# EasyEDA Pro project DRV8262_breakout_2024-04-23.epro

# Schematic DRV8262_breakout
Create Date: 2024-03-21; Page Name: P1; Project Name: DRV8262_breakout; Schematic Name: DRV8262_breakout_5; Update Date: 2024-04-23; Company: Tux-Robotik; Drawn: Louis Bertelsmann; Page Size: A5; Part Number: DRV8262; Reviewed: Louis Bertelsmann; Version: V1.0
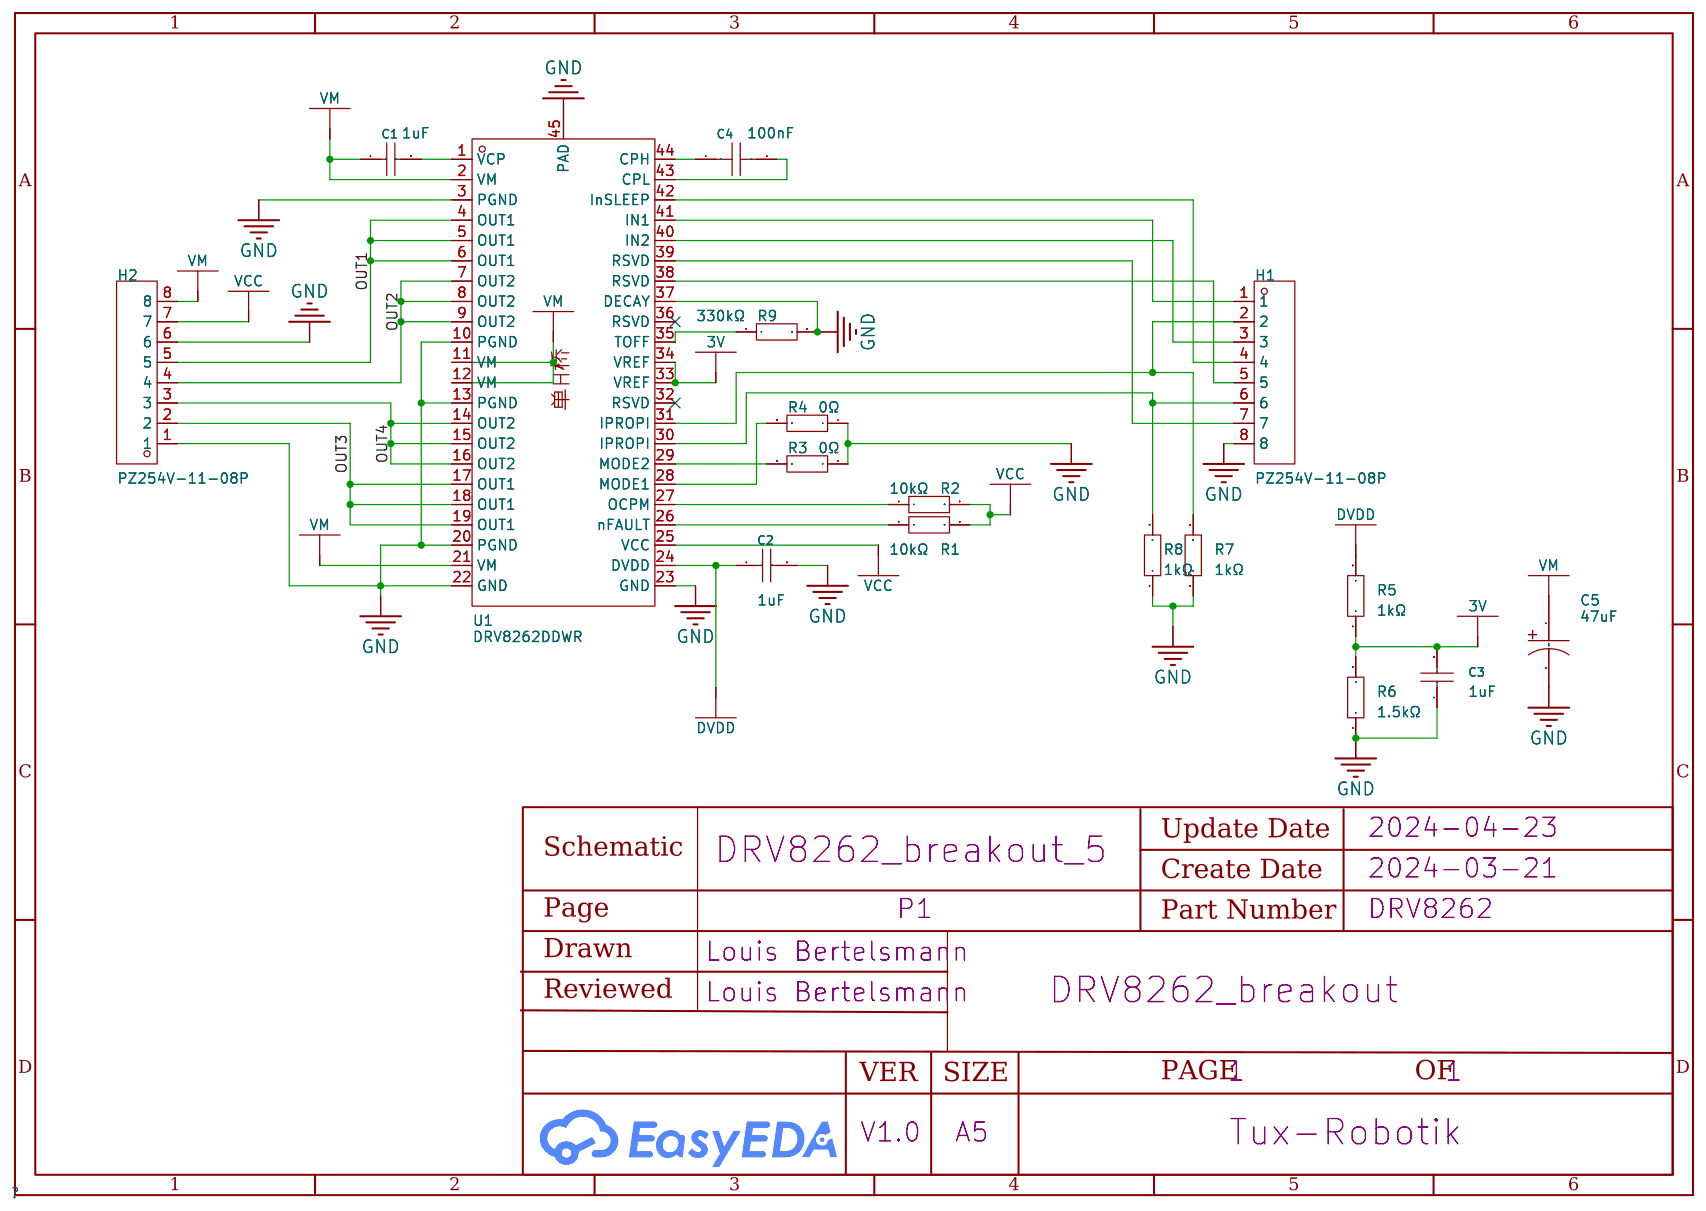
[diagram p0: schematic sheet]

## Parts
C1  1uF  [C0603]
C2  1uF  [C0603]
C3  1uF  [C0603]
C4  100nF  [C0603]
C5  47uF  [CAP-SMD_BD6.3-L6.6-W6.6-LS7.2-FD]
H1  PZ254V-11-08P  [HDR-TH_8P-P2.54-V-M]
H2  PZ254V-11-08P  [HDR-TH_8P-P2.54-V-M]
R1  10kΩ  [R0603]
R2  10kΩ  [R0603]
R3  0Ω  [R0603]
R4  0Ω  [R0603]
R5  1kΩ  [R0603]
R6  1.5kΩ  [R0603]
R7  1kΩ  [R0603]
R8  1kΩ  [R0603]
R9  330kΩ  [R0603]
U1  DRV8262DDWR  [HTSSOP-44_L14.0-W6.1-P0.64-LS8.1-BL-EP-2]

## Library data of the parts
C1-C3 = CL10A105KB8NNNC: Capacitance: Tolerance:±10% Tolerance:±10% Voltage Rated: Temperature Coefficient:; LCSC Part Name: 1uF ±10% 50V; Supplier Part: C15849; Manufacturer: SAMSUNG(三星); Supplier Footprint: 0603; JLCPCB Part Class: Basic Part; Datasheet: https://atta.szlcsc.com/upload/public/pdf/source/20160218/1457707763339.pdf; Supplier: LCSC; Tolerance: ±10%
C4 = CL10B104KC8NNNC: Capacitance: Tolerance:±10% Tolerance:±10% Voltage Rated: Temperature Coefficient:; LCSC Part Name: 100nF ±10% 100V; Supplier Part: C15725; Manufacturer: SAMSUNG(三星); Supplier Footprint: 0603; JLCPCB Part Class: Extended Part; Datasheet: https://atta.szlcsc.com/upload/public/pdf/source/20160218/1457707763339.pdf; Supplier: LCSC; Tolerance: ±10%
C5 = MVK25V47M6.3*5 6.3TP: Capacitance: Tolerance:±20% Tolerance:±20% Rated Voltage: Ripple Current:- Equivalent Series Resistance(ESR):- φD: L: Lifetime @ Temp:1000hrs@105℃ Operating Temperature:-40℃~+105℃ Operating Temperature:-40℃~+105℃; LCSC Part Name: 47uF ±20% 25V; Supplier Part: C346941; Manufacturer: SAMYOUNG(韩国三莹); Supplier Footprint: SMD,D6.3xL5mm; JLCPCB Part Class: Extended Part; Datasheet: https://atta.szlcsc.com/upload/public/pdf/source/20181213/C346985_7C716E870CB004139321FDD94F15CCBE.pdf; Supplier: LCSC; Tolerance: ±20%; Lifetime @ Temp: 1000hrs@105℃; Operating Temperature: -40℃~+105℃
H1 H2 = PZ254V-11-08P: Pin Structure:1x8P Pitch:2.54mm Row Spacing:- Circluar Pins/Square Pins:Square Pins Mounting Type:Straight Number of Rows:Plugin Number of Pins:8P Current Rating (Max):- Voltage Rating (Max):- Length of Mating Pin:6mm Insulation Height:2.5mm Length of End; LCSC Part Name: 间距:2.54mm 1x8P 直插 方针; Supplier Part: C492407; Manufacturer: XFCN(兴飞); Supplier Footprint: 插件,P=2.54mm; JLCPCB Part Class: Extended Part; Datasheet: https://atta.szlcsc.com/upload/public/pdf/source/20200309/C492407_83A6FB26A2233368EDB9516968EC6149.pdf; Supplier: LCSC; Pin Structure: 1x8P; Pitch: 2.54mm; Circluar Pins/Square Pins: Square Pins; Mounting Type: Straight; Number of Rows: Plugin; Number of Pins: 8P; Length of Mating Pin: 6mm; Insulation Height: 2.5mm; Length of End Connection Pin: 3mm; Operating Temperature Range: -40℃~+105℃; Color: Black
R1 R2 = AC0603FR-0710KL: Type:Thick Film Resistors Resistance: Tolerance:±1% Tolerance:±1% Power(Watts): Overload Voltage (Max): Temperature Coefficient:±100ppm/℃ Temperature Coefficient:±100ppm/℃ Operating Temperature Range:-55℃~+155℃ Operating Temperature Range:-55℃~+155℃; LCSC Part Name: 厚膜电阻 10kΩ ±1% 100mW; Supplier Part: C116677; Manufacturer: YAGEO(国巨); Supplier Footprint: 0603; JLCPCB Part Class: Extended Part; Datasheet: https://atta.szlcsc.com/upload/public/pdf/source/20180927/C229861_4ABDC471507C1ED6AFB4BA66AFC8620A.pdf; Supplier: LCSC; Type: Thick Film Resistors; Tolerance: ±1%; Temperature Coefficient: ±100ppm/℃; Operating Temperature Range: -55℃~+155℃
R3 R4 = RC0603JR-070RL: Type:Thick Film Resistors Resistance: Tolerance:±5% Tolerance:±5% Power(Watts): Overload Voltage (Max): Operating Temperature Range:-55℃~+155℃ Operating Temperature Range:-55℃~+155℃; LCSC Part Name: 厚膜电阻 0Ω ±5% 100mW; Supplier Part: C95177; Manufacturer: YAGEO(国巨); Supplier Footprint: 0603; JLCPCB Part Class: Extended Part; Datasheet: https://atta.szlcsc.com/upload/public/pdf/source/20170818/C126805_1503051298841895366.pdf; Supplier: LCSC; Type: Thick Film Resistors; Tolerance: ±5%; Operating Temperature Range: -55℃~+155℃
R5 R7 R8 = RC0603FR-071KL: Type:Thick Film Resistors Resistance: Tolerance:±1% Tolerance:±1% Power(Watts): Overload Voltage (Max): Temperature Coefficient:±100ppm/℃ Temperature Coefficient:±100ppm/℃ Operating Temperature Range:-55℃~+155℃ Operating Temperature Range:-55℃~+155℃; LCSC Part Name: 厚膜电阻 1kΩ ±1% 100mW; Supplier Part: C22548; Manufacturer: YAGEO(国巨); Supplier Footprint: 0603; JLCPCB Part Class: Extended Part; Datasheet: https://atta.szlcsc.com/upload/public/pdf/source/20180316/70C0E2BDAE7FCC62C531A5A58D202EE1.pdf; Supplier: LCSC; Type: Thick Film Resistors; Tolerance: ±1%; Temperature Coefficient: ±100ppm/℃; Operating Temperature Range: -55℃~+155℃
R6 = RC0603FR-071K5L: Type:Thick Film Resistors Resistance: Tolerance:±1% Tolerance:±1% Power(Watts): Overload Voltage (Max): Temperature Coefficient:±100ppm/℃ Temperature Coefficient:±100ppm/℃ Operating Temperature Range:-55℃~+155℃ Operating Temperature Range:-55℃~+155℃; LCSC Part Name: 厚膜电阻 1.5kΩ ±1% 100mW; Supplier Part: C114668; Manufacturer: YAGEO(国巨); Supplier Footprint: 0603; JLCPCB Part Class: Extended Part; Datasheet: https://atta.szlcsc.com/upload/public/pdf/source/20180821/C275644_0D56F95EFF785E7D9A1FEF436B37DA78.pdf; Supplier: LCSC; Type: Thick Film Resistors; Tolerance: ±1%; Temperature Coefficient: ±100ppm/℃; Operating Temperature Range: -55℃~+155℃
R9 = RC0603FR-07330KL: Type:Thick Film Resistors Resistance: Tolerance:±1% Tolerance:±1% Power(Watts): Overload Voltage (Max): Temperature Coefficient:±100ppm/℃ Temperature Coefficient:±100ppm/℃ Operating Temperature Range:-55℃~+155℃ Operating Temperature Range:-55℃~+155℃; LCSC Part Name: 厚膜电阻 330kΩ ±1% 100mW; Supplier Part: C114618; Manufacturer: YAGEO(国巨); Supplier Footprint: 0603; JLCPCB Part Class: Extended Part; Datasheet: https://atta.szlcsc.com/upload/public/pdf/source/20180228/C114618_15198052576021377096.pdf; Supplier: LCSC; Type: Thick Film Resistors; Tolerance: ±1%; Temperature Coefficient: ±100ppm/℃; Operating Temperature Range: -55℃~+155℃
U1 = DRV8262DDWR: Supplier Part: C9900057349; Supplier Footprint: HTSSOP-44; Supplier: LCSC

## Nets
3V: C3.2 R5.1 R6.2 U1.33(VREF) U1.34(VREF)
DVDD: C2.1 R5.2 U1.24(DVDD)
GND: C2.2 C3.1 C5.2 H1.8 H2.1 H2.6 R3.1 R4.1 R6.1 R7.1 R8.1 R9.2 U1.3(PGND) U1.10(PGND) U1.13(PGND) U1.20(PGND) U1.22(GND) U1.23(GND) U1.37(DECAY) U1.45(PAD)
VCC: H2.7 R1.2 R2.2 U1.25(VCC)
OUT1: H2.5 U1.4(OUT1) U1.5(OUT1) U1.6(OUT1)
OUT2: H2.4 U1.7(OUT2) U1.8(OUT2) U1.9(OUT2)
OUT3: H2.2 U1.17(OUT1) U1.18(OUT1) U1.19(OUT1)
OUT4: H2.3 U1.14(OUT2) U1.15(OUT2) U1.16(OUT2)
VM: C1.1 C5.1 H2.8 U1.2(VM) U1.11(VM) U1.12(VM) U1.21(VM)
$1N1100: C1.2 U1.1(VCP)
$1N1121: R1.1 U1.26(nFAULT)
$1N1123: R2.1 U1.27(OCPM)
$1N1163: R9.1 U1.35(TOFF)
$1N1186: H1.4 U1.42(InSLEEP)
$1N1194: H1.2 R7.2 U1.31(IPROPI)
$1N1201: H1.6 R8.2 U1.30(IPROPI)
$1N1208: C4.1 U1.44(CPH)
$1N1210: C4.2 U1.43(CPL)
$1N1757: R4.2 U1.28(MODE1)
$1N1763: R3.2 U1.29(MODE2)
$1N4044: H1.7 U1.39(RSVD)
$1N4166: H1.5 U1.38(RSVD)
$1N4295: H1.3 U1.40(IN2)
$1N4296: H1.1 U1.41(IN1)

Not connected (* = marked no-connect by the designer): U1 32(RSVD)* 36(RSVD)*

# Board PCB1
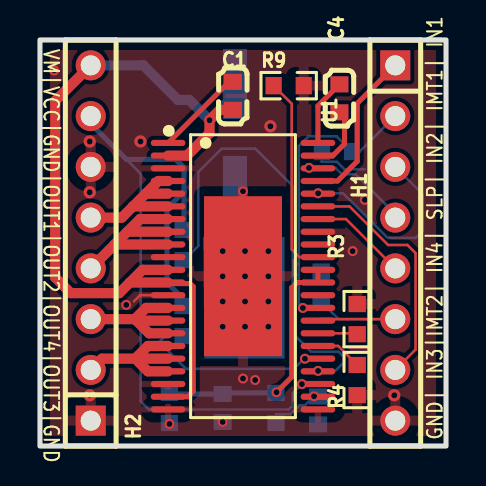
[diagram p1: board, top side]
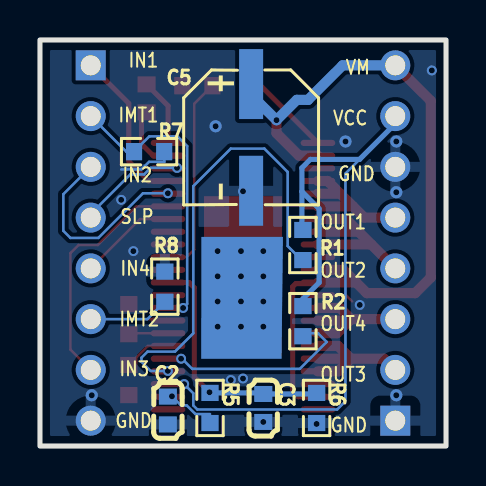
[diagram p2: board, bottom side, seen from below]

Outline 20.32 x 20.32 mm; copper layers: Top Layer, Bottom Layer. Coordinates in mm from the lower left corner of the outline.
Outline path: rectangle 0,20.32 20.32,0
Stack: Top Layer 0.035mm / Dielectric1 1.51mm FR4 er 4.5 / Bottom Layer 0.035mm

## Design rules (mm)
template: Custom Config
spacing copperThickness1oz (default): track to track 0.102, other pairs 0.152 to 0.3
spacing copperThickness2oz: track to track 0.203, other pairs 0.152 to 0.3
track width copperThickness1oz (default): min 0.127, default 0.254, max 2.54
track width copperThickness2oz: min 0.203, default 0.254, max 2.54
differential pair differentialPair (default): width min 0.127, default 0.254, max 2.54; gap min 0.152, default 0.152
via viaSize (default): diameter min 0.2, default 0.61, max 10; hole min 0.1, default 0.305, max 6.3

## Placement (name value [footprint] x y rotation side)
C1  1uF  [C0603]  9.65 17.53 90 top
C2  1uF  [C0603]  13.92 1.78 270 bottom
C3  1uF  [C0603]  9.14 1.91 90 bottom
C4  100nF  [C0603]  14.99 17.4 270 top
C5  47uF  [CAP-SMD_BD6.3-L6.6-W6.6-LS7.2-FD]  9.75 15.44 270 bottom
H1  PZ254V-11-08P  [HDR-TH_8P-P2.54-V-M]  17.78 10.16 270 top
H2  PZ254V-11-08P  [HDR-TH_8P-P2.54-V-M]  2.54 10.16 90 top
NOREF  -  [Pad_e148]  10.22 7.42 0 top
R1  10kΩ  [R0603]  7.16 10.06 90 bottom
R2  10kΩ  [R0603]  7.16 6.25 90 bottom
R3  0Ω  [R0603]  15.88 6.35 270 top
R4  0Ω  [R0603]  15.88 3.3 90 top
R5  1kΩ  [R0603]  11.81 1.91 270 bottom
R6  1.5kΩ  [R0603]  6.48 1.91 90 bottom
R7  1kΩ  [R0603]  14.86 14.73 0 bottom
R8  1kΩ  [R0603]  14.07 7.98 270 bottom
R9  330kΩ  [R0603]  12.45 18.03 0 top
U1  DRV8262DDWR  [HTSSOP-44_L14.0-W6.1-P0.64-LS8.1-BL-EP-2]  10.16 8.5 270 top

## Footprints (pads in the part's own frame, mm; a bottom-side part is the same pattern mirrored in y, then rotated)
C0603
  rect 0.8x0.9 smd: 1(-0.7,0) 2(0.7,0)
CAP-SMD_BD6.3-L6.6-W6.6-LS7.2-FD
  rect 3.5x1.2 smd: 1(-2.67,0) 2(2.67,0)
HDR-TH_8P-P2.54-V-M
  rect 1.5x1.5 hole 1: 1(-8.89,0)
  round 1.5 hole 1: 2(-6.35,0) 3(-3.81,0) 4(-1.27,0) 5(1.27,0) 6(3.81,0) 7(6.35,0) 8(8.89,0)
HTSSOP-44_L14.0-W6.1-P0.64-LS8.1-BL-EP-2
  oval 0.308x1.729 smd: 1(-6.668,-3.75) 2(-6.032,-3.75) 3(-5.397,-3.75) 4(-4.763,-3.75) 5(-4.128,-3.75) 6(-3.493,-3.75) 7(-2.857,-3.75) 8(-2.223,-3.75) 9(-1.587,-3.75) 10(-0.953,-3.75) 11(-0.318,-3.75) 12(0.318,-3.75) 13(0.953,-3.75) 14(1.587,-3.75) 15(2.223,-3.75) 16(2.857,-3.75) 17(3.493,-3.75) 18(4.128,-3.75) 19(4.763,-3.75) 20(5.397,-3.75) 21(6.032,-3.75) 22(6.668,-3.75) 23(6.668,3.75) 24(6.032,3.75) 25(5.397,3.75) 26(4.763,3.75) 27(4.128,3.75) 28(3.493,3.75) 29(2.857,3.75) 30(2.223,3.75) 31(1.587,3.75) 32(0.953,3.75) 33(0.318,3.75) 34(-0.318,3.75) 35(-0.953,3.75) 36(-1.587,3.75) 37(-2.223,3.75) 38(-2.857,3.75) 39(-3.493,3.75) 40(-4.128,3.75) 41(-4.763,3.75) 42(-5.397,3.75) 43(-6.032,3.75) 44(-6.668,3.75)
  rect 8x3.9 smd: 45(0,0)
Pad_e148
  custom 4.084x6.095 smd far side: 46(0,0)
R0603
  rect 0.806x0.864 smd: 1(-0.753,0) 2(0.753,0)

## Nets
As in the schematic, except:
GND: C2.2 C3.1 C5.2 H1.8 H2.1 H2.6 NOREF.46 R3.1 R4.1 R6.1 R7.1 R8.1 R9.2 U1.3 U1.10 U1.13 U1.20 U1.22 U1.23 U1.37 U1.45

Pads without a net: U1 32 36

## Via types
v1: diameter 0.5, hole 0.3, Top Layer to Bottom Layer, 18 vias
v2: diameter 0.6, hole 0.3, Top Layer to Bottom Layer, 12 vias
v3: diameter 0.61, hole 0.304, Top Layer to Bottom Layer, 6 vias

## Routing (per net, layer and track width the routed paths; a pad name or vN(x,y) marks a point on that pad's centre or on a via; arc(x,y) is an arc through that point)
3V: length 13
  Top Layer w0.254: U1.34 U1.33 12.86,8.18 12.6,7.92 12.6,3.45 v1(11.84,2.69)
  Bottom Layer w0.254: R5.1 9.2,2.66 C3.2 6.53,2.61 R6.2
DVDD: length 2.5
  Bottom Layer w0.127: 13.92,2.43 13.86,2.49 v1(13.72,2.49) 13.26,2.03 12.97,2.03 12.54,1.6 11.81,1.6
GND: length 4.7
  Top Layer w0.127: U1.13 5.01,7.55 4.7,7.24
  Bottom Layer w0.127: R7.1 14.1,14.22 14.86,14.22 15.24,13.84 16.26,13.84
  vias: v1(0.71,18.8) v1(4.32,7.06) v1(6.48,1.11) v1(9.14,1.2) v1(10.16,12.75) v1(10.16,3.38) v1(10.77,3.3) v1(15.65,9.75) v1(16.26,12.32) v2(9.14,9.75) v2(9.14,8.49) v2(9.14,7.23) v2(9.14,5.97) v2(10.26,9.75) v2(10.26,8.49) v2(10.26,7.23) v2(10.26,5.97) v2(11.43,9.75) v2(11.43,8.49) v2(11.43,7.23) v2(11.43,5.97) v3(2.49,15.24) v3(2.49,12.7) v3(2.49,2.54) v3(5.03,15.24) v3(11.53,16) v3(17.73,2.54)
VCC: length 37
  Bottom Layer w0.127: v1(13.11,3.1) 12.65,2.64 12.65,2.03 12.45,1.83 5.45,1.83 5.03,2.24 5.03,13.64 4.33,14.34
  Bottom Layer w0.254: 7.21,12.74 7.21,10.86 R1.2 ; 7.21,12.74 7.21,13.92 6.79,14.34 4.33,14.34 2.54,16.13 H2.7 ; 7.21,12.74 6.35,11.87 6.35,8.18 7.16,7.37 R2.2
OUT1: length 7.5
  Top Layer w0.508: U1.6 4.66,11.99 ; 4.66,11.99 4.09,11.43 H2.5 ; 4.66,11.99 5.29,12.63 ; 5.29,12.63 U1.5 ; 5.29,12.63 5.93,13.26 U1.4
OUT2: length 9.6
  Top Layer w0.508: 4.37,10.72 5.01,11.36 U1.7 ; 4.37,10.72 3.74,10.09 ; 4.37,10.72 U1.8 ; 3.74,10.09 H2.4 ; 3.74,10.09 U1.9
OUT3: length 7.9
  Top Layer w0.508: U1.17 5.4,5.01 4.77,4.37 ; H2.2 3.1,4.37 4.77,4.37 ; 4.77,4.37 5.4,3.74 U1.19 ; 4.77,4.37 U1.18
OUT4: length 7.6
  Top Layer w0.508: U1.14 5.31,6.91 4.75,6.35 ; 4.75,6.35 4.82,6.28 ; 4.75,6.35 H2.3 ; 4.82,6.28 5.46,5.64 U1.16 ; 4.82,6.28 U1.15
VM: length 41.7
  Top Layer w0.254: U1.12 6.46,8.13 7.52,8.13 7.67,7.98 7.67,2.74 7.4,2.47 U1.21
  Top Layer w0.508: U1.2 7.36,14.53 8.48,15.66 8.48,16.3 ; v1(8.48,16.31) 9,16.83 C1.1 ; H2.8 0.76,17.27 0.76,8.43 1.54,7.65 3.97,7.65 4.5,8.18 ; 4.5,8.18 5.13,8.82 U1.11 ; 4.5,8.18 U1.12
  Bottom Layer w0.508: H2.8 5.17,19.05 6.9,17.32 7.47,17.32 v1(8.48,16.31) 9.75,17.58 C5.1
$1N1100: length 4.5
  Top Layer w0.254: C1.2 9.47,18.23 U1.1
$1N1121: length 22.9
  Bottom Layer w0.127: 7.21,9.3 7.93,10.01 7.93,13.72 9.09,14.88 10.77,14.88 12.65,13 12.65,5.64 13.56,4.72 14.94,4.72 15.24,4.42 15.24,4.22 14.78,3.76 v1(13.92,3.76)
$1N1123: length 9.1
  Bottom Layer w0.127: 13.21,4.37 12.7,3.86 7.31,3.86 5.97,5.21 6.41,5.65 6.86,5.65
  vias: v1(13.26,4.37)
$1N1163: length 10
  Top Layer w0.127: U1.35 12.98,9.45 12.6,9.84 12.6,17.13 R9.1
$1N1186: length 5.5
  Bottom Layer w0.127: H1.4 17.78,11.61 15.8,13.59 15.11,13.59 14.78,13.92 v1(13.46,13.92)
$1N1194: length 14.3
  Bottom Layer w0.127: v1(13.16,6.91) 12.95,7.11 12.95,15.01 13.44,15.49 14.85,15.49 R7.2 16,14.73 H1.2
$1N1201: length 8
  Top Layer w0.127: H1.6 13.98,6.35 U1.30
  Bottom Layer w0.127: H1.6 14.94,6.35 R8.2
$1N1208: length 3.4
  Top Layer w0.254: C4.1 13.91,17.02 U1.44
$1N1210: length 3.3
  Top Layer w0.254: C4.2 15.24,16.44 15.24,15.11 14.66,14.53 U1.43
$1N1757: length 2.4
  Top Layer w0.127: U1.28 14.92,5.01 R4.2
$1N1763: length 2
  Top Layer w0.127: R3.2 15.83,5.64 U1.29
$1N4044: length 12.1
  Top Layer w0.127: U1.39 15.49,11.99 17.42,10.06 18.39,10.06 18.8,9.65 18.8,4.83 H1.7
$1N4166: length 4.9
  Top Layer w0.127: U1.38 15.31,11.36 H1.5
$1N4295: length 10.1
  Bottom Layer w0.127: v1(13.92,12.65) 15.16,12.65 17.4,10.41 18.8,10.41 19.15,10.77 19.15,12.6 H1.3
$1N4296: length 8
  Top Layer w0.254: U1.41 14.89,13.26 15.88,14.25 15.88,17.14 H1.1

## Copper pours and planes (outline as drawn; the poured copper is in the pictures)
GND on Top Layer: 0,20.32 20.32,20.32 20.32,0 0,0
GND on Bottom Layer: -0.05,20.32 20.27,20.32 20.27,0 -0.05,0

## Text on the board
Bottom Silkscreen Layer: IN1 | IN2 | SLP | IN4 | IMT2 | IN3 | IMT1 | GND | VM | VCC | OUT1 | OUT2 | OUT4 | OUT3
Top Silkscreen Layer: VM|VCC|GND|OUT1|OUT2|OUT4|OUT3|GND | GND| IN3|IMT2| IN4| SLP| IN2| IMT1| IN1
